# Altium schematic sheet Oscar_MainBoard_UartUSB.SchDoc
size A4
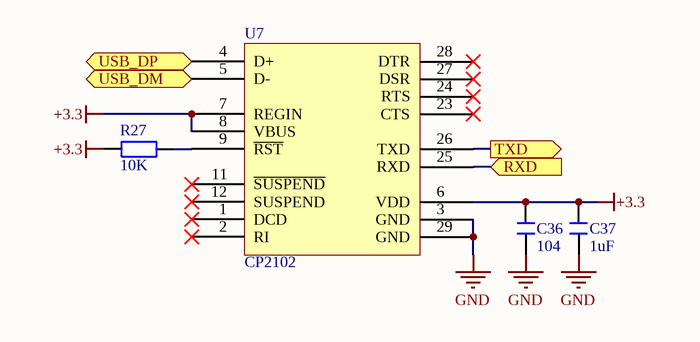
[diagram p0: Oscar_MainBoard_UartUSB.SchDoc]

## Parts
C36  104  [C 0402_L]
C37  1uF  [C 0402_L]
R27  10K  [R 0402_L]
U7  CP2102  [QFN28 5x5_N]

## Ports
RXD (in), TXD (out), USB_DM, USB_DP

## Nets
+3.3: C36.2 C37.2 R27.1 U7.6(VDD) U7.7(REGIN) U7.8(VBUS)
GND: C36.1 C37.1 U7.3(GND) U7.29(GND)
RXD: U7.25(RXD) ; port RXD
TXD: U7.26(TXD) ; port TXD
USB_DM: U7.5(D-) ; port USB_DM
USB_DP: U7.4(D+) ; port USB_DP
NetR27_2: R27.2 U7.9(~{RST})

Not connected (* = marked no-connect by the designer): U7 1(DCD)* 2(RI)* 11(~{SUSPEND})* 12(SUSPEND)* 23(CTS)* 24(RTS)* 27(DSR)* 28(DTR)*

## Library data of the parts
C36 C37 = C: 贴片电容; BOM名称: 无极性贴片电容; 优秀评价可免费更新: 联系淘宝ID：黄晶宝石，获取更新版封装库; 卖家免费技术支持，联系售后: 唯一出售店铺网址https://shop463601444.taobao.com; 本封装库来自淘宝卖家 ID：黄晶宝石: 其他店铺购入均为盗版，请立即申请退款
R27 = R: 贴片电阻; 优秀评价可免费更新: 联系淘宝ID：黄晶宝石，获取更新版封装库; 卖家免费技术支持，联系售后: 唯一出售店铺网址https://shop463601444.taobao.com; 本封装库来自淘宝卖家 ID：黄晶宝石: 其他店铺购入均为盗版，请立即申请退款; BOM名称: 贴片电阻
U7 = CP2102: CP2102 uart usb